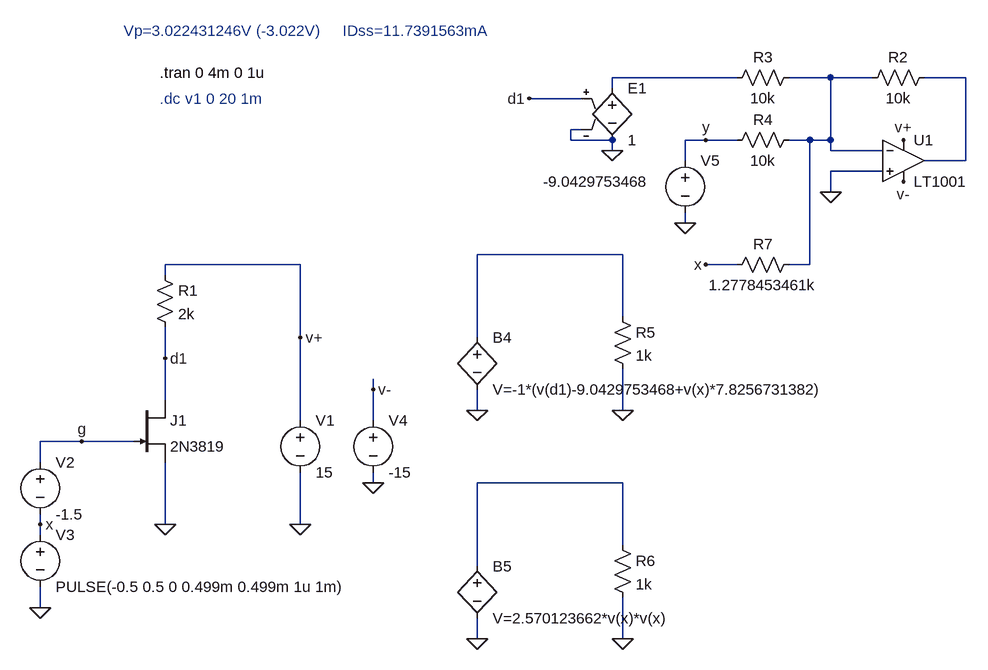
[diagram p0: schematic jfet_transf4.asc]
jfet_transf4.asc, the LTspice schematic file:
Version 4
SHEET 1 2756 740
WIRE 1120 -352 928 -352
WIRE 1264 -352 1200 -352
WIRE 1328 -352 1264 -352
WIRE 1472 -352 1408 -352
WIRE 928 -336 928 -352
WIRE 880 -320 800 -320
WIRE 880 -272 864 -272
WIRE 864 -256 864 -272
WIRE 928 -256 864 -256
WIRE 1072 -256 1040 -256
WIRE 1120 -256 1072 -256
WIRE 1232 -256 1200 -256
WIRE 1264 -256 1264 -352
WIRE 1264 -256 1232 -256
WIRE 928 -240 928 -256
WIRE 1264 -240 1264 -256
WIRE 1344 -240 1264 -240
WIRE 1040 -224 1040 -256
WIRE 1472 -224 1472 -352
WIRE 1472 -224 1408 -224
WIRE 1344 -208 1264 -208
WIRE 1264 -176 1264 -208
WIRE 1040 -128 1040 -144
WIRE 944 -80 720 -80
WIRE 448 -64 240 -64
WIRE 1120 -64 1072 -64
WIRE 1232 -64 1232 -256
WIRE 1232 -64 1200 -64
WIRE 240 -48 240 -64
WIRE 944 16 944 -80
WIRE 448 48 448 -64
WIRE 720 48 720 -80
WIRE 240 80 240 32
WIRE 560 128 560 112
WIRE 240 144 240 80
WIRE 720 160 720 128
WIRE 944 160 944 96
WIRE 448 176 448 48
WIRE 560 176 560 128
WIRE 112 208 48 208
WIRE 192 208 112 208
WIRE 48 240 48 208
WIRE 560 272 560 256
WIRE 944 272 720 272
WIRE 48 336 48 320
WIRE 240 336 240 240
WIRE 448 336 448 256
WIRE 48 352 48 336
WIRE 944 368 944 272
WIRE 720 400 720 272
WIRE 48 464 48 432
WIRE 720 512 720 480
WIRE 944 512 944 448
FLAG 240 336 0
FLAG 448 336 0
FLAG 48 464 0
FLAG 112 208 g
FLAG 48 336 x
FLAG 240 80 d1
FLAG 720 160 0
FLAG 944 160 0
FLAG 720 512 0
FLAG 944 512 0
FLAG 448 48 v+
FLAG 560 272 0
FLAG 560 128 v-
FLAG 1376 -256 v+
FLAG 1376 -192 v-
FLAG 1264 -176 0
FLAG 928 -240 0
FLAG 800 -320 d1
FLAG 1072 -256 y
FLAG 1040 -128 0
FLAG 1072 -64 x
SYMBOL njf 192 144 R0
SYMATTR InstName J1
SYMATTR Value 2N3819
SYMBOL voltage 448 160 R0
WINDOW 123 0 0 Left 0
WINDOW 39 0 0 Left 0
SYMATTR InstName V1
SYMATTR Value 15
SYMBOL voltage 48 224 R0
WINDOW 123 0 0 Left 0
WINDOW 39 0 0 Left 0
SYMATTR InstName V2
SYMATTR Value -1.5
SYMBOL voltage 48 336 R0
WINDOW 123 0 0 Left 0
WINDOW 39 0 0 Left 0
SYMATTR InstName V3
SYMATTR Value PULSE(-0.5 0.5 0 0.499m 0.499m 1u 1m)
SYMBOL res 224 -64 R0
SYMATTR InstName R1
SYMATTR Value 2k
SYMBOL bv 720 32 R0
SYMATTR InstName B4
SYMATTR Value V=-1*(v(d1)-9.0429753468+v(x)*7.8256731382)
SYMBOL res 928 0 R0
SYMATTR InstName R5
SYMATTR Value 1k
SYMBOL bv 720 384 R0
SYMATTR InstName B5
SYMATTR Value V=2.570123662*v(x)*v(x)
SYMBOL res 928 352 R0
SYMATTR InstName R6
SYMATTR Value 1k
SYMBOL voltage 560 160 R0
WINDOW 123 0 0 Left 0
WINDOW 39 0 0 Left 0
SYMATTR InstName V4
SYMATTR Value -15
SYMBOL OpAmps\\LT1001 1376 -288 R0
SYMATTR InstName U1
SYMBOL res 1424 -368 R90
WINDOW 0 0 56 VBottom 2
WINDOW 3 32 56 VTop 2
SYMATTR InstName R2
SYMATTR Value 10k
SYMBOL res 1216 -368 R90
WINDOW 0 0 56 VBottom 2
WINDOW 3 32 56 VTop 2
SYMATTR InstName R3
SYMATTR Value 10k
SYMBOL e 928 -352 R0
SYMATTR InstName E1
SYMATTR Value 1
SYMBOL res 1216 -272 R90
WINDOW 0 0 56 VBottom 2
WINDOW 3 32 56 VTop 2
SYMATTR InstName R4
SYMATTR Value 10k
SYMBOL voltage 1040 -240 R0
WINDOW 3 -218 48 Left 2
WINDOW 123 0 0 Left 0
WINDOW 39 0 0 Left 0
SYMATTR InstName V5
SYMATTR Value -9.0429753468
SYMBOL res 1216 -80 R90
WINDOW 0 0 56 VBottom 2
WINDOW 3 32 56 VTop 2
SYMATTR InstName R7
SYMATTR Value 1.2778453461k
TEXT 176 -424 Left 2 ;Vp=3.022431246V (-3.022V)     IDss=11.7391563mA
TEXT 232 -320 Left 2 ;.dc v1 0 20 1m
TEXT 232 -360 Left 2 !.tran 0 4m 0 1u

The netlist it stands for:
* jfet_transf4.asc
J1 d1 g 0 2N3819
V1 v+ 0 15
V2 g x -1.5
V3 x 0 PULSE(-0.5 0.5 0 0.499m 0.499m 1u 1m)
R1 v+ d1 2k
B4 N004 0 V=-1*(v(d1)-9.0429753468+v(x)*7.8256731382)
R5 N004 0 1k
B5 N005 0 V=2.570123662*v(x)*v(x)
R6 N005 0 1k
V4 v- 0 -15
XU1 0 N002 v+ v- N003 LT1001  ; pins In+ In- V+ V- OUT
R2 N003 N002 10k
R3 N002 N001 10k
E1 N001 0 d1 0 1
R4 N002 y 10k
V5 y 0 -9.0429753468
R7 N002 x 1.2778453461k
.model NJF NJF
.model PJF PJF
.lib standard.jft
* Vp=3.022431246V (-3.022V)     IDss=11.7391563mA
* .dc v1 0 20 1m
.tran 0 4m 0 1u
.lib LTC.lib
.backanno
.end